# EAGLE design FM-Simple-Regen (EAGLE 7.2.0)
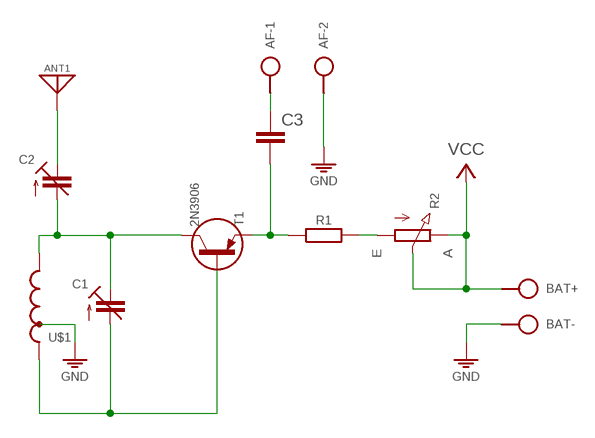
[diagram p0: schematic, sheet 1]

## Parts
AF  SPAD-2  [SPAD-2]
ANT1  ANT  [SPAD]
BAT+  SPAD  [SPAD]
BAT-  SPAD  [SPAD]
C1  C-TR-PH201272222-808-2PINB  [TRIM-2222-808]
C2  C-TR-PH201272222-808-2PIN  [TRIM-2222-808]
C3  C050-024X044  [C050-024X044]
R1  R-H0204/10  [0204/10]
R2  POT  [POT]
T1  2N3906  [TO92]
U$1  L-TAP104/7  [L-04/10-TAP1]

## Nets
GND: AF.2 BAT-.1 U$1.T
N$1: C1.2(A) T1.2(B) U$1.1
N$2: AF.1 C3.1
N$3: C1.3(E) C2.2(A) T1.3(C) U$1.2
N$4: C3.2 R1.1 T1.1(E)
N$5: R1.2 R2.A
N$7: ANT1.1 C2.1(E)
VCC: BAT+.1 R2.E R2.S

## Library data of the parts
AF = pad:SPAD-2
ANT1 = pad:ANT
BAT+ BAT- = pad:SPAD
C1 C2 = cap-trim:C-TR-PH20127
C3 = c:C: CAPACITOR, European symbol
R1 = r:R-H
R2 = r:POT
T1 = t:2N3906
U$1 = l:L-TAP1

## Board
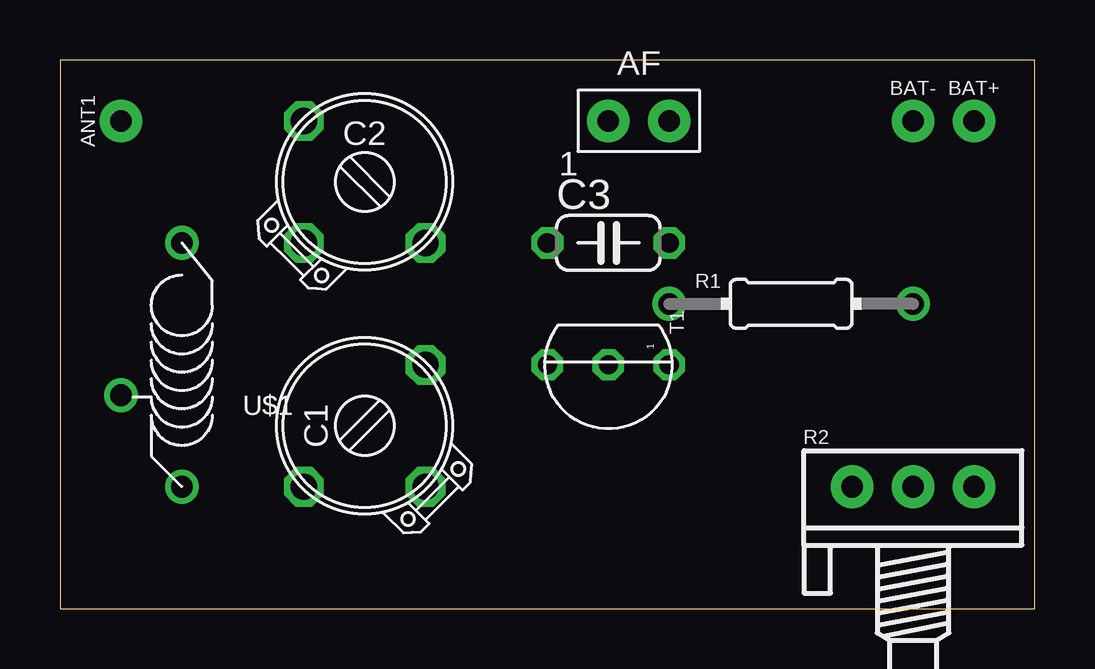
[diagram p1: board, top side]
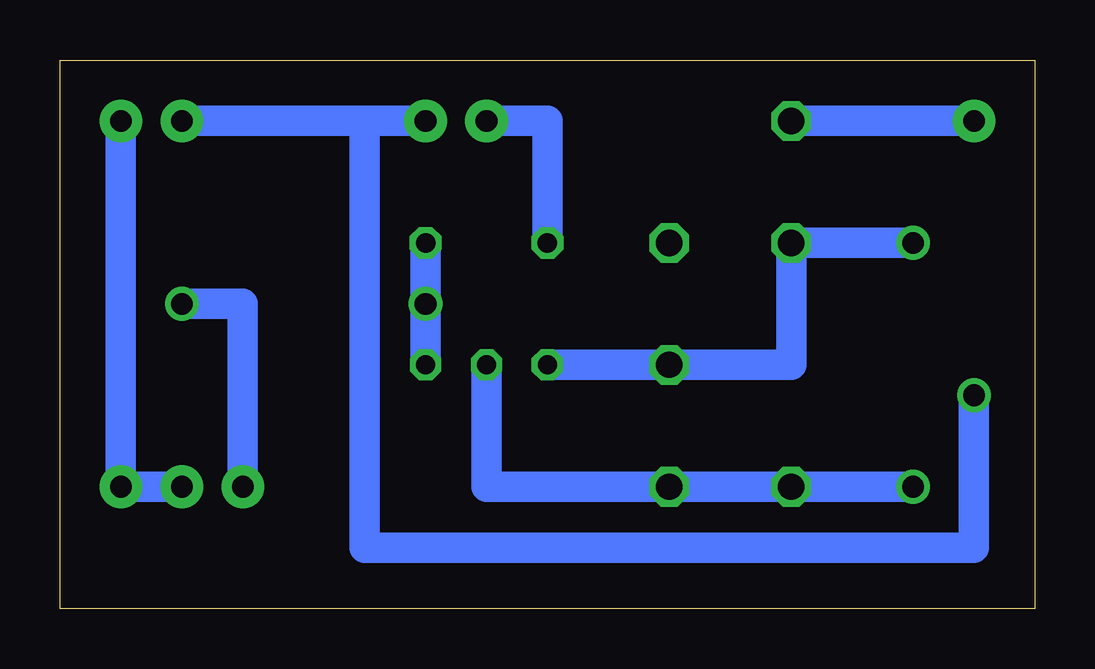
[diagram p2: board, bottom side, seen from below]

Size 40.64 x 22.86 mm. Coordinates in mm from the lower left corner, seen from the top.
Outline: 0,0 40.64,0 40.64,22.86 0,22.86 0,0
Copper layers (1*16): Top 0.035mm / dielectric 1.5mm / Bottom 0.035mm
Design rules "default": minimum track width 10mil, minimum drill 24mil, track to track 8mil, track to pad 8mil, pad to pad 8mil, via to via 8mil, smd to smd 8mil, copper to edge 40mil, drill to drill 8mil, minimum pad ring 10mil, minimum via ring 8mil, stop-mask expansion 4mil, vias tented up to drill 0mil, thermal gap 10mil

### Footprints (pad centres in the part's own frame; a part is rotated, then mirrored left to right if it is on the bottom)
SPAD-2 = drill 0.9 pad 1.778: 1 0,-1.27; 2 0,1.27
SPAD = drill 0.9 pad 1.778: 1 0,0
TRIM-2222-808 = drill 1.1 octagon: 1 -2.54,2.54; 2 -2.54,-2.54; 3 2.54,-2.54
C050-024X044 = drill 0.813 octagon: 1 -2.54,0; 2 2.54,0
0204/10 = drill 0.9: 1 -5.08,0; 2 5.08,0
POT = drill 0.9 pad 1.778: A -2.54,0; E 2.54,0; S 0,0
TO92 = drill 0.8 octagon: 1 0,2.54; 2 0,0; 3 0,-2.54
L-04/10-TAP1 = drill 0.9: 1 0,5.08; 2 0,-5.08; T 2.54,1.27

### Placement (x,y rotation side)
AF  24.13,20.32 270 top
ANT1  2.54,20.32 0 top
BAT+  38.1,20.32 270 top
BAT-  35.56,20.32 270 top
C1  12.7,7.62 90 top
C2  12.7,17.78 0 top
C3  22.86,15.24 0 top
R1  30.48,12.7 0 top
R2  35.56,5.08 0 top
T1  22.86,10.16 270 top
U$1  5.08,10.16 180 top

### Tracks (layer width: path | path; a pad name or v marks a point on that pad's centre or on a via)
GND
  Bottom 1.27: U$1.T 2.54,2.54 27.94,2.54 27.94,20.32 | 27.94,20.32 AF.2 | BAT-.1 27.94,20.32
N$1
  Bottom 1.27: T1.2 22.86,5.08 C1.2 U$1.1
N$2
  Bottom 1.27: C3.1 20.32,20.32 AF.1
N$3
  Bottom 1.27: T1.3 C1.3 10.16,10.16 C2.2 U$1.2
N$4
  Bottom 1.27: C3.2 R1.1 T1.1
N$5
  Bottom 1.27: R1.2 33.02,12.7 R2.A
N$7
  Bottom 1.27: C2.1 ANT1.1 6.35,20.32
VCC
  Bottom 1.27: R2.S R2.E BAT+.1